# EAGLE design rev10 (EAGLE 7.5.0)
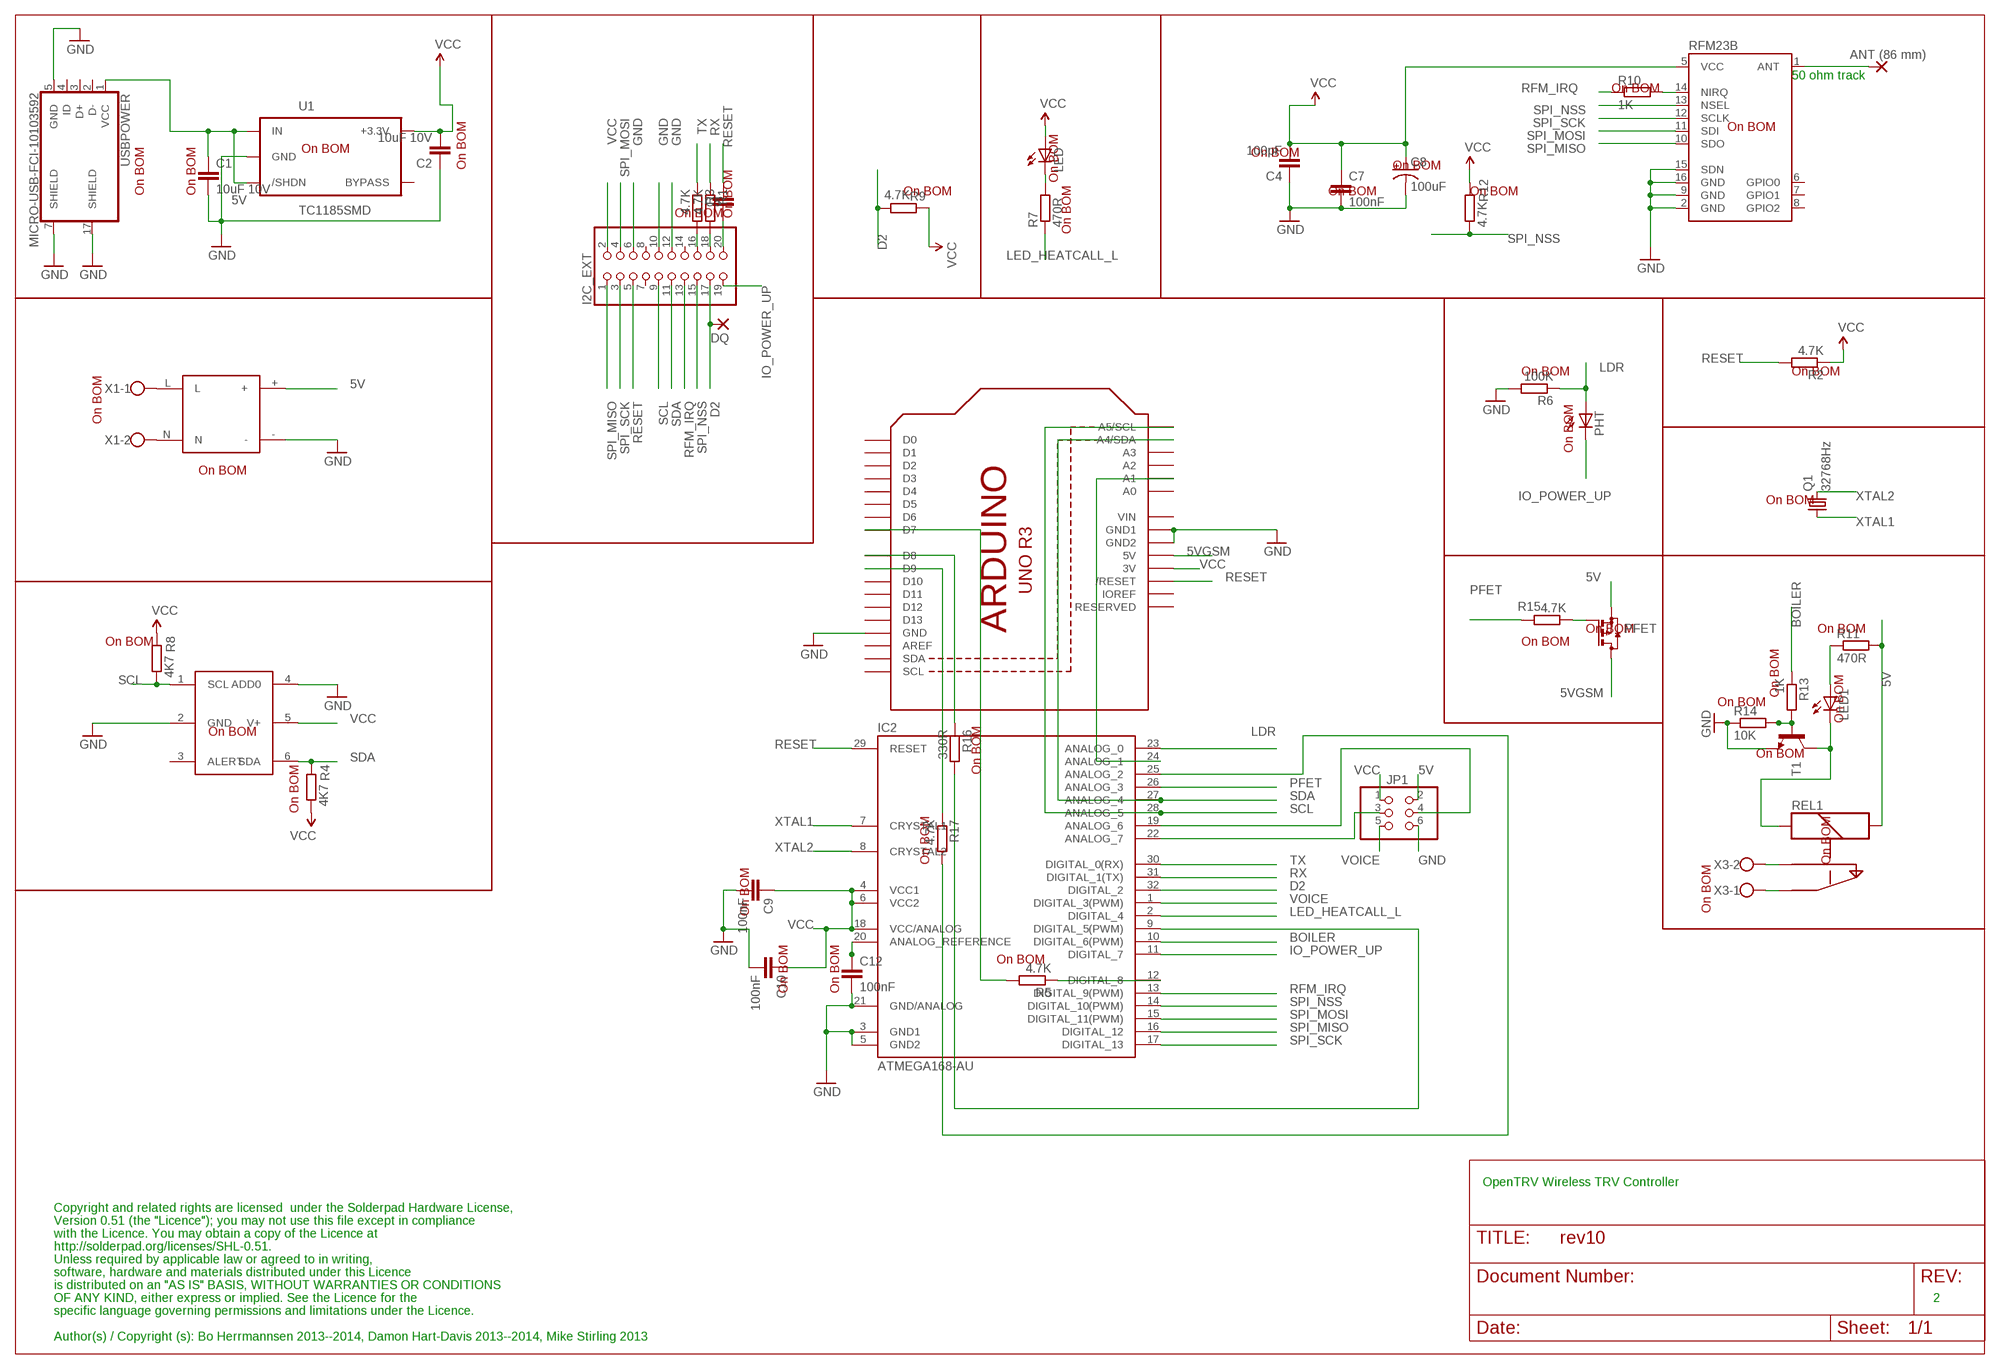
[diagram p0: schematic, sheet 1]

## Parts
ANT1  ANT (86 mm)  2,15/1,0  [2,15/1,0]
C1  10uF 10V  C-EUC0603  [C0603]
C2  10uF 10V  C-EUC0603  [C0603]
C4  100pF  C-EUC0603  [C0603]
C5  100nF  C-EUC0603  [C0603]
C7  100nF  C-EUC0603  [C0603]
C8  100uF  CAP_POL1206  [EIA3216]
C9  100nF  C-EUC0603  [C0603]
C10  100nF  C-EUC0603  [C0603]
C12  100nF  C-EUC0603  [C0603]
DQ  2,15/1,0  [2,15/1,0]
I2C_EXT  PINHD-2X10  [2X10]
IC2  ATMEGA168-AU  [TQFP32-08]
JP1  PINHD-2X3  [2X03]
LED  LEDCHIP-LED0603  [CHIP-LED0603]
LED1  LEDCHIP-LED0603  [CHIP-LED0603]
PFET  BSS84  [SOT23]
PHT  BPX65  [BPX65]
PSU  VTX-214-010-205  [VTX-214-010-205]
Q1  32768Hz  MC-306  [MC-306]
R1  4.7K  R-EU_R0603  [R0603]
R2  4.7K  R-EU_R0603  [R0603]
R3  4.7K  R-EU_R0603  [R0603]
R4  4K7  R-EU_R0603  [R0603]
R5  4.7K  R-EU_R0603  [R0603]
R6  100K  R-EU_R0603  [R0603]
R7  470R  R-EU_R0603  [R0603]
R8  4K7  R-EU_R0603  [R0603]
R9  4.7K  R-EU_R0603  [R0603]
R10  1K  R-EU_R0603  [R0603]
R11  470R  R-EU_R0603  [R0603]
R12  4.7K  R-EU_R0603  [R0603]
R13  1K  R-EU_R0603  [R0603]
R14  10K  R-EU_R0603  [R0603]
R15  4.7K  R-EU_R0603  [R0603]
R16  330R  R-EU_R0603  [R0603]
R17  4.7K  R-EU_R0603  [R0603]
REL1  OJE-SS-103HM  [OJE-SS-103HM]
RFM23B  RFM23B  [RFM23-XXX-S1]
T1  MMBTH24LT1-NPN-SOT23-BEC  [SOT23-BEC]
TMP112  TMP1  TMP112  [TMP112]
U1  TC1185SMD  [TC1185]
U$3  ARDUINO  [ARDUINO]
USBPOWER  MICRO-USB-FCI-10103592  [MICRO-USB-FCI-10103592]
X1  W237-102  [W237-102]
X3  W237-102  [W237-102]

## Nets
5V [supply]: C1.1 JP1.2 PFET.2(S) PSU.+ R11.2 REL1.S2 U1.1(IN) U1.3(/SHDN) USBPOWER.1(VCC)
5VGSM: PFET.3(D) U$3.5V
BOILER: IC2.10(DIGITAL_6(PWM)) R13.1
D2: DQ.1(P) I2C_EXT.17 IC2.32(DIGITAL_2) R9.1
GND [supply]: C1.2 C2.1 C4.1 C7.2 C8.C(-) C9.2 C10.2 C12.2 I2C_EXT.6 I2C_EXT.10 I2C_EXT.12 IC2.3(GND1) IC2.5(GND2) IC2.21(GND/ANALOG) JP1.6 PSU.- R6.2 R14.1 RFM23B.2(GND) RFM23B.9(GND) RFM23B.15(SDN) RFM23B.16(GND) T1.E TMP112.2(GND) TMP112.4(ADD0) U1.2(GND) U$3.GND U$3.GND1 U$3.GND2 USBPOWER.5(GND) USBPOWER.7(SHIELD) USBPOWER.17(SHIELD)
IO_POWER_UP [supply]: I2C_EXT.19 IC2.11(DIGITAL_7) PHT.K(C)
LDR: IC2.23(ANALOG_0) PHT.A R6.1
LED_HEATCALL_L: IC2.2(DIGITAL_4) R7.1
N$1: IC2.19(ANALOG_6) JP1.4
N$3: IC2.12(DIGITAL_8) R5.1
N$4: PSU.N X1.2
N$5: IC2.22(ANALOG_7) JP1.3
N$6 [supply]: C12.1 IC2.20(ANALOG_REFERENCE)
N$7: R10.2 RFM23B.14(NIRQ)
N$8: PSU.L X1.1
N$11: IC2.25(ANALOG_2) R17.2
N$12: R13.2 R14.2 T1.B
N$13: LED.C R7.2
N$14: LED1.C REL1.S1 T1.C
N$15: IC2.24(ANALOG_1) U$3.A1
N$16: LED1.A R11.1
N$17: PFET.1(G) R15.1
N$19: R5.2 U$3.D7
N$20: IC2.9(DIGITAL_5(PWM)) R16.2
N$21: REL1.C X3.1
N$22: REL1.S X3.2
N$24: I2C_EXT.18 R1.2
N$25: I2C_EXT.16 R3.2
N$26: C5.2 I2C_EXT.20
N$30: R17.1 U$3.D9
N$31 [ant]: ANT1.1(P) RFM23B.1(ANT)
N$32: R16.1 U$3.D8
PFET: IC2.26(ANALOG_3) R15.2
RESET: C5.1 I2C_EXT.5 IC2.29(RESET) R2.2 U$3.RESET(/RESET)
RFM_IRQ: I2C_EXT.13 IC2.13(DIGITAL_9(PWM)) R10.1
RX: IC2.31(DIGITAL_1(TX)) R1.1
SCL: I2C_EXT.9 IC2.28(ANALOG_5) R8.1 TMP112.1(SCL) U$3.A5(A5/SCL)
SDA: I2C_EXT.11 IC2.27(ANALOG_4) R4.2 TMP112.6(SDA) U$3.A4(A4/SDA)
SPI_MISO: I2C_EXT.1 IC2.16(DIGITAL_12) RFM23B.10(SDO)
SPI_MOSI: I2C_EXT.4 IC2.15(DIGITAL_11(PWM)) RFM23B.11(SDI)
SPI_NSS: I2C_EXT.15 IC2.14(DIGITAL_10(PWM)) R12.1 RFM23B.13(NSEL)
SPI_SCK: I2C_EXT.3 IC2.17(DIGITAL_13) RFM23B.12(SCLK)
TX: IC2.30(DIGITAL_0(RX)) R3.1
VCC [supply]: C2.2 C4.2 C7.1 C8.A(+) C9.1 C10.1 I2C_EXT.2 IC2.4(VCC1) IC2.6(VCC2) IC2.18(VCC/ANALOG) JP1.1 LED.A R2.1 R4.1 R8.2 R9.2 R12.2 RFM23B.5(VCC) TMP112.5(V+) U1.5(+3.3V) U$3.3V
VOICE: IC2.1(DIGITAL_3(PWM)) JP1.5
XTAL1: IC2.7(CRYSTAL1) Q1.1
XTAL2: IC2.8(CRYSTAL2) Q1.4
Unconnected: I2C_EXT.7 I2C_EXT.8 I2C_EXT.14 RFM23B.6(GPIO0) RFM23B.7(GPIO1) RFM23B.8(GPIO2) TMP112.3(ALERT) U1.4(BYPASS) U$3.A0 U$3.A2 U$3.A3 U$3.AREF U$3.D0 U$3.D1 U$3.D2 U$3.D3 U$3.D4 U$3.D5 U$3.D6 U$3.D10 U$3.D11 U$3.D12 U$3.D13 U$3.IOREF U$3.RESERVED U$3.SCL U$3.SDA USBPOWER.2(D-) USBPOWER.3(D+) USBPOWER.4(ID)

## Notes on the sheet
- 50 ohm track
- On BOM
- On BOM
- On BOM
- On BOM
- On BOM | On BOM | On BOM
- On BOM
- On BOM | On BOM | On BOM | On BOM | On BOM
- On BOM
- On BOM
- On BOM | On BOM | On BOM
- On BOM
- On BOM
- On BOM
- On BOM | On BOM
- On BOM | On BOM
- On BOM | On BOM
- On BOM
- On BOM
- On BOM
- On BOM
- On BOM
- On BOM | On BOM | On BOM
- On BOM
- On BOM
- On BOM | On BOM
- OpenTRV Wireless TRV Controller
- Copyright and related rights are licensed  under the Solderpad Hardware License,
- Version 0.51 (the "Licence"); you may not use this file except in compliance
- with the Licence. You may obtain a copy of the Licence at
- http://solderpad.org/licenses/SHL-0.51.
- Unless required by applicable law or agreed to in writing,
- software, hardware and materials distributed under this Licence
- is distributed on an "AS IS" BASIS, WITHOUT WARRANTIES OR CONDITIONS
- OF ANY KIND, either express or implied. See the Licence for the | 2
- specific language governing permissions and limitations under the Licence.
- Author(s) / Copyright (s): Bo Herrmannsen 2013--2014, Damon Hart-Davis 2013--2014, Mike Stirling 2013

## Power pins joined to a net without a drawn wire
VIN: U$3.VIN

## Library data of the parts
ANT1 DQ = wirepad:2,15/1,0: THROUGH-HOLE PAD
C1 C2 C4 C5 C7 C9 C10 C12 = resistor:C-EU: CAPACITOR, European symbol
C8 = SparkFun-Passives:CAP_POL: Capacitor Polarized These are standard SMD and PTH capacitors. Normally 10uF, 47uF, and 100uF in electrolytic and tantalum varieties. Always verify the external diameter of the through hole cap, it varies with capacity, voltage, and manufacturer. The EIA devices should be standard.
I2C_EXT = pinhead:PINHD-2X10: PIN HEADER
IC2 = Arduino-AVR:ATMEGA168
JP1 = pinhead:PINHD-2X3: PIN HEADER
LED LED1 = led:LED: LED OSRAM: - CHIPLED LG R971, LG N971, LY N971, LG Q971, LY Q971, LO R971, LY R971 LH N974, LH R974 LS Q976, LO Q976, LY Q976 LO Q996 - Hyper CHIPLED LW Q18S LB Q993, LB Q99A, LB R99A - SideLED LS A670, LO A670, LY A670, LG A670, LP A670 LB A673, LV A673, LT A673, LW A673 LH A674 LY A675 LS A676, LA A676, LO A676, LY A676, LW A676 LS A679, LY A679, LG A679 - Hyper Micro SIDELED® LS Y876, LA Y876, LO Y876, LY Y876 LT Y87S - SmartLED LW L88C, LW L88S LB L89C, LB L89S, LG L890 LS L89K, LO L89K, LY L89K LS L896, LA L896, LO L896, LY L896 - TOPLED LS T670, LO T670, LY T670, LG T670, LP T670 LSG T670, LSP T670, LSY T670, LOP T670, LYG T670 LG T671, LOG T671, LSG T671 LB T673, LV T673, LT T673, LW T673 LH T674 LS T676, LA T676, LO T676, LY T676, LB T676, LH T676, LSB T676, LW T676 LB T67C, LV T67C, LT T67C, LS T67K, LO T67K, LY T67K, LW E67C LS E67B, LA E67B, LO E67B, LY E67B, LB E67C, LV E67C, LT E67C LW T67C LS T679, LY T679, LG T679 LS T770, LO T770, LY T770, LG T770, LP T770 LB T773, LV T773, LT T773, LW T773 LH T774 LS E675, LA E675, LY E675, LS T675 LS T776, LA T776, LO T776, LY T776, LB T776 LHGB T686 LT T68C, LB T68C - Hyper Mini TOPLED® LB M676 - Mini TOPLED Santana® LG M470 LS M47K, LO M47K, LY M47K Source: http://www.osram.convergy.de LUXEON: - LUMILED® LXK2-PW12-R00, LXK2-PW12-S00, LXK2-PW14-U00, LXK2-PW14-V00 LXK2-PM12-R00, LXK2-PM12-S00, LXK2-PM14-U00 LXK2-PE12-Q00, LXK2-PE12-R00, LXK2-PE12-S00, LXK2-PE14-T00, LXK2-PE14-U00 LXK2-PB12-K00, LXK2-PB12-L00, LXK2-PB12-M00, LXK2-PB14-N00, LXK2-PB14-P00, LXK2-PB14-Q00 LXK2-PR12-L00, LXK2-PR12-M00, LXK2-PR14-Q00, LXK2-PR14-R00 LXK2-PD12-Q00, LXK2-PD12-R00, LXK2-PD12-S00 LXK2-PH12-R00, LXK2-PH12-S00 LXK2-PL12-P00, LXK2-PL12-Q00, LXK2-PL12-R00 Source: www.luxeon.com KINGBRIGHT: KA-3528ASYC Source: www.kingbright.com
PFET = transistor-small-signal:BSS84: P-CHANNEL MOS FET
PHT = opto-trans-siemens:BPX65: PHOTO DIODE; MPN: BPX65.; OC_FARNELL: 327451; OC_NEWARK: 06WX2764
PSU = VTX-214-010-205:VTX-214-010-205
Q1 = crystal:MC-306: kHz RANGE CRYSTAL UNIT SMD Source: MC-306_405_406_E07X.PDF Homepage <http://www.epsontoyocom.co.jp>; MPN: MC-306 60.0KHZ 100PPM ,12.5PF; OC_FARNELL: 1278040; OC_NEWARK: 31M5576
R1-R17 = resistor:R-EU_: RESISTOR, European symbol
REL1 = OJE-SS-103HM:OJE-SS-103HM: RELAY
RFM23B = SparkFun-RF:RFM23B
T1 = transistor:*-NPN-: NPN Transistror BF959 corrected 2008.03.06
TMP112 = TMP112_2:TMP112
U1 = 3.3VREG:TC1185
U$3 = arduino:ARDUINO
USBPOWER = micro-usb-fci-10103592:MICRO-USB-FCI-10103592: Micro USB B Connector RS No: 714-2334 MRF No: 10103592-0001LF
X1 X3 = con-wago-500:W237-102: WAGO SCREW CLAMP; MPN: 237-102; OC_FARNELL: unknown; OC_NEWARK: 70K9898

## Net classes
0 default: width 0.203 mm
1 supply: width 0.406 mm, clearance 0.203 mm
2 ant: width 2.184 mm

## Board
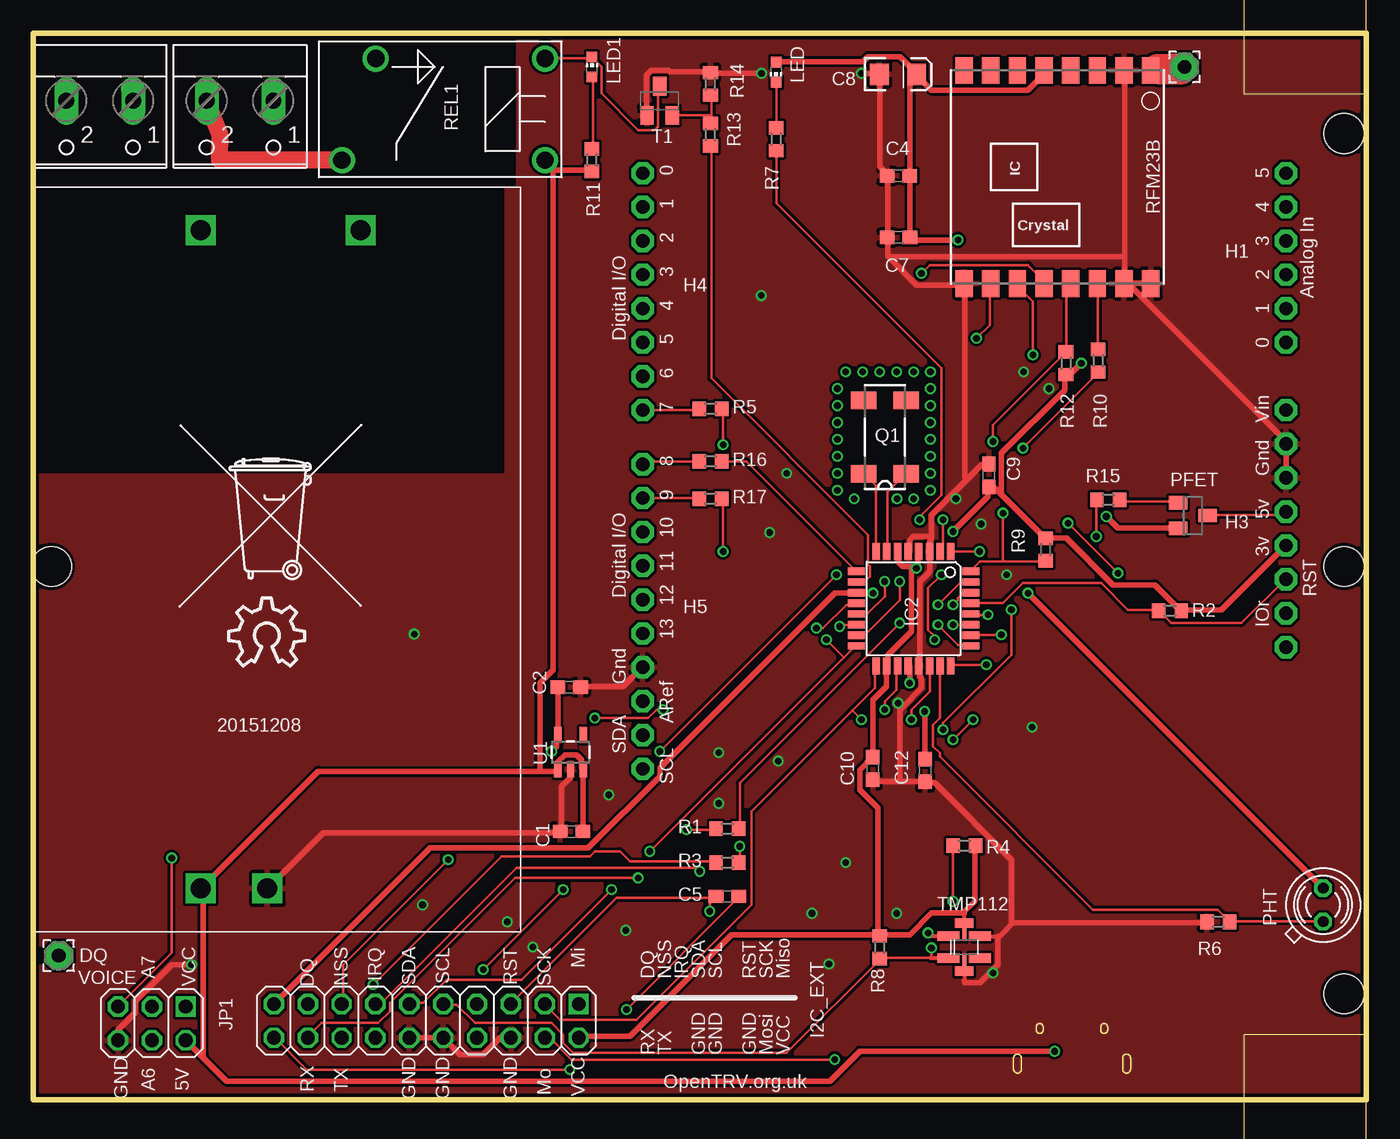
[diagram p1: board, top side]
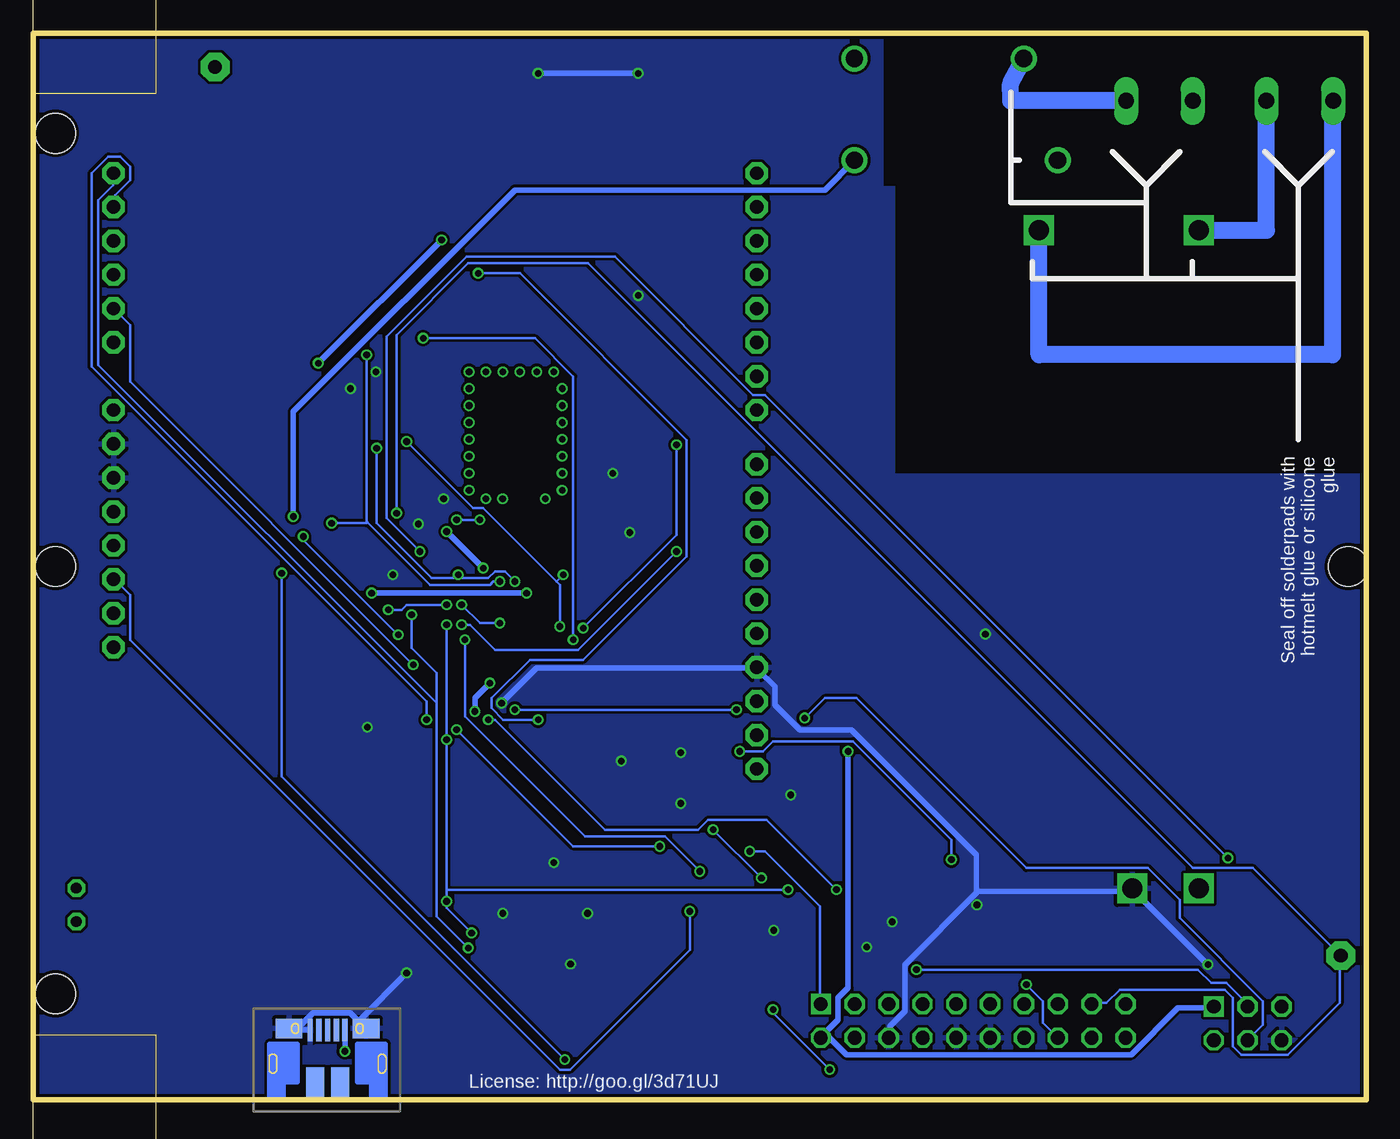
[diagram p2: board, bottom side, seen from below]

Size 100 x 80 mm. Coordinates in mm from the lower left corner, seen from the top.
Outline: 0,0 0,80 100,80 100,0 0,0
Copper layers (1*16): Top 0.035mm / dielectric 1.5mm / Bottom 0.035mm
Design rules "PMServicesStd *": minimum track width 8mil, minimum drill 0.5mm, track to track 8mil, track to pad 8mil, pad to pad 8mil, via to via 8mil, smd to smd 0mil, copper to edge 10mil, drill to drill 10mil, minimum pad ring 10mil, minimum via ring 6mil, stop-mask expansion 2mil, vias tented up to drill 100mil, thermal gap 10mil
Holes 3 mm at 98.33,7.93 98.33,72.5 1.35,40 98.33,40
tRestrict: area 0,52.1 to 30.2,76.8; area 0,47 to 30.2,71.8; area 29.8,68.6 to 36.2,80; area 5.1,47 to 35.3,71.8
bRestrict: area 0,52.1 to 30.2,76.8; area 0,47 to 30.2,71.8; area 29.8,68.6 to 36.2,80; area 5.1,47 to 35.3,71.8
Milling: area 90.8,-4.3 to 100,4.8; area 90.8,75.5 to 100,84.7

### Footprints (pad centres in the part's own frame; a part is rotated, then mirrored left to right if it is on the bottom)
2,15/1,0 = drill 1.016 pad 2.159 octagon: 1 0,0
C0603 = smd 1.1 x 1: 1 -0.85,0; 2 0.85,0
EIA3216 = smd 1.4 x 1.6: A 1.4,0; C -1.4,0
2X10 = drill 1.016 square: 1 -11.43,-1.27 | drill 1.016 octagon: 2 -11.43,1.27; 3 -8.89,-1.27; 4 -8.89,1.27; 5 -6.35,-1.27; 6 -6.35,1.27; 7 -3.81,-1.27; 8 -3.81,1.27; 9 -1.27,-1.27; 10 -1.27,1.27; 11 1.27,-1.27; 12 1.27,1.27; 13 3.81,-1.27; 14 3.81,1.27; 15 6.35,-1.27; 16 6.35,1.27; 17 8.89,-1.27; 18 8.89,1.27; 19 11.43,-1.27; 20 11.43,1.27
TQFP32-08 = smd 1.27 x 0.559: 1 -4.293,2.8; 2 -4.293,2; 3 -4.293,1.2; 4 -4.293,0.4; 5 -4.293,-0.4; 6 -4.293,-1.2; 7 -4.293,-2; 8 -4.293,-2.8; 17 4.293,-2.8; 18 4.293,-2; 19 4.293,-1.2; 20 4.293,-0.4; 21 4.293,0.4; 22 4.293,1.2; 23 4.293,2; 24 4.293,2.8 | smd 0.559 x 1.27: 9 -2.8,-4.293; 10 -2,-4.293; 11 -1.2,-4.293; 12 -0.4,-4.293; 13 0.4,-4.293; 14 1.2,-4.293; 15 2,-4.293; 16 2.8,-4.293; 25 2.8,4.293; 26 2,4.293; 27 1.2,4.293; 28 0.4,4.293; 29 -0.4,4.293; 30 -1.2,4.293; 31 -2,4.293; 32 -2.8,4.293
2X03 = drill 1.016 square: 1 -2.54,-1.27 | drill 1.016 octagon: 2 -2.54,1.27; 3 0,-1.27; 4 0,1.27; 5 2.54,-1.27; 6 2.54,1.27
CHIP-LED0603 = smd 0.8 x 0.8: A 0,-0.75; C 0,0.75
SOT23 = smd 1 x 1.4: 1 -0.95,-1.1; 2 0.95,-1.1; 3 0,1.1
BPX65 = drill 0.813 octagon: A -0.889,-0.889; K 0.889,0.889
VTX-214-010-205 = drill 1.5 square: + 52.75,9.24; - 52.75,14.24; L 3.36,9.24; N 3.36,21.24
MC-306 = smd 1.3 x 1.9: 1 -2.75,-1.6; 2 2.75,-1.6; 3 2.75,1.6; 4 -2.75,1.6
R0603 = smd 1 x 1.1: 1 -0.85,0; 2 0.85,0
OJE-SS-103HM = drill 1.3: C 13.95,1.29; S 16.49,8.91; S1 1.25,1.29; S2 1.25,8.91
RFM23-XXX-S1 = smd 2 x 1.3: 1 -8,7; 2 -8,5; 3 -8,3; 4 -8,1; 5 -8,-1; 6 -8,-3; 7 -8,-5; 8 -8,-7; 9 8,-7; 10 8,-5; 11 8,-3; 12 8,-1; 13 8,1; 14 8,3; 15 8,5; 16 8,7
SOT23-EBC = smd 1 x 1.4: B 0.95,-1.1; C 0,1.1; E -0.95,-1.1
TMP112 = smd 0.285 x 0.7: 1 -0.5,-0.825; 2 0,-0.825; 3 0.5,-0.825; 4 0.5,0.825; 5 0,0.825; 6 -0.5,0.825; 7 0.777,-0.825; 8 1.325,-0.825; 9 1.05,-0.825; 10 1.868,-0.826; 11 1.595,-0.826; 12 -1.863,-0.825; 13 -1.314,-0.825; 14 -1.59,-0.825; 15 -0.772,-0.825; 16 -1.044,-0.825; 17 -1.86,0.822; 18 -1.312,0.822; 19 -1.587,0.822; 20 -0.769,0.821; 21 -1.041,0.821; 22 0.766,0.824; 23 1.315,0.824; 24 1.039,0.824; 25 1.857,0.823; 26 1.585,0.823; 27 -0.548,1.797; 28 0,1.797; 29 -0.275,1.797; 30 0.543,1.797; 31 0.271,1.797; 32 0.001,1.383; 33 -0.548,-1.798; 34 0,-1.798; 35 -0.275,-1.798; 36 0.543,-1.799; 37 0.271,-1.799; 38 0,-1.322
TC1185 = smd 0.55 x 1.2: 1 -0.95,-1.3; 2 0,-1.3; 3 0.95,-1.3; 4 0.95,1.3; 5 -0.95,1.3
ARDUINO = drill 1 pad 1.676 octagon: 3V 26.67,5.08; 5V 29.21,5.08; A0 41.91,5.08; A1 44.45,5.08; A2 46.99,5.08; A3 49.53,5.08; A4 52.07,5.08; A5 54.61,5.08; AREF 14.986,53.34; D0 54.61,53.34; D1 52.07,53.34; D2 49.53,53.34; D3 46.99,53.34; D4 44.45,53.34; D5 41.91,53.34; D6 39.37,53.34; D7 36.83,53.34; D8 32.766,53.34; D9 30.226,53.34; D10 27.686,53.34; D11 25.146,53.34; D12 22.606,53.34; D13 20.066,53.34; GND 17.526,53.34; GND1 34.29,5.08; GND2 31.75,5.08; IOREF 21.59,5.08; RESERVED 19.05,5.08; RESET 24.13,5.08; SCL 9.906,53.34; SDA 12.446,53.34; VIN 36.83,5.08
MICRO-USB-FCI-10103592 = smd 0.4 x 1.71: 1 3.84,2.51; 2 3.19,2.51; 3 2.54,2.51; 4 1.89,2.51; 5 1.24,2.51 | smd 2 x 1.46: 7 -0.36,2.64; 17 5.44,2.64 | smd 1.375 x 2.5: 11 1.603,-1.52; 12 3.478,-1.52
W237-102 = drill 1.194 long: 1 -2.5,-1.27; 2 2.5,-1.27

### Placement (x,y rotation side)
ANT1  86.36,77.47 0 top
C1  40.38,20.12 180 top
C2  40.2,30.94 180 top
C4  64.91,69.3 0 top
C5  52.07,15.24 0 top
C7  64.92,64.68 180 top
C8  64.89,76.92 0 top
C9  71.69,46.83 90 top
C10  62.98,24.84 270 top
C12  66.91,24.69 270 top
DQ  1.91,10.79 0 top
I2C_EXT  29.48,5.9 180 top
IC2  66.04,36.83 270 top
JP1  8.89,5.71 180 top
LED  55.73,77.08 180 top
LED1  41.91,77.47 0 top
PFET  87,43.81 270 top
PHT  96.77,14.61 45 top
PSU  3.31,68.58 270 top
Q1  63.89,49.71 90 top
R1  52.07,20.32 180 top
R2  85.28,36.67 180 top
R3  52.07,17.78 180 top
R4  69.85,19.05 180 top
R5  50.8,51.84 180 top
R6  88.9,13.34 180 top
R7  55.73,72.05 90 top
R8  63.5,11.43 90 top
R9  75.94,41.27 90 top
R10  79.9,55.43 90 top
R11  41.91,70.48 270 top
R12  77.47,55.24 270 top
R13  50.8,72.39 90 top
R14  50.8,76.2 270 top
R15  80.64,44.99 180 top
R16  50.8,47.88 0 top
R17  50.8,45.09 0 top
REL1  39.64,79.39 180 top
RFM23B  76.83,69.22 270 top
T1  [SOT23-EBC]  46.99,74.93 0 top
TMP112  69.85,11.43 0 top
U1  40.31,26.05 0 top
U$1  [OSHW_10X200_NOTEXT]  14.67,32.54 0 top
U$2  [TONNE]  17.64,41.06 0 top
U$3  99.06,14.9 90 top
USBPOWER  80.47,2.7 0 bottom
X1  4.98,73.66 180 top
X3  15.51,73.66 180 top

### Tracks (layer width: path | path; a pad name or v marks a point on that pad's centre or on a via)
5V  (via drill 0.5)
  Top 0.406: 39.12,69.75 41.88,69.75 R11.2 | REL1.S2 39.12,69.75 | v80.5,43.75 81.38,42.88 85.88,42.88 PFET.2 | C1.1 41.25,20.12 U1.3 41.12,24.88 41.12,25.5 40.75,25.88 39.88,25.88 39.38,25.38 39.38,24.88 U1.1 39.25,24.62 38,24.62 | 38,24.62 21.38,24.62 12.62,15.88 PSU.+ 12.75,15.75 12.75,3.38 12.62,3.25 | v76.62,3.62 62,3.62 59.75,1.38 14.5,1.38 12.62,3.25 | JP1.2 12.62,3.25 | 38,24.62 38,31.25 39,32.25 39,69.62 39.12,69.75
  Bottom 0.406: v80.5,43.75 80.5,51.62 63.88,68.25 40.62,68.25 REL1.S2 | v76.62,3.62 USBPOWER.1
5VGSM
  Top 0.203: PFET.3 88.12,43.88 93.75,43.88 93.88,44 U$3.5V
BOILER
  Top 0.203: R13.1 50.88,71.5 50.88,54.12 62.62,42.38 62.62,40.12 62.75,40 62.75,39.25 62.38,38.88 61.75,38.88 IC2.10
D2  (via drill 0.5)
  Top 0.203: 72.75,40.38 71,40.38 70.38,39.75 IC2.32 | 72.75,40.38 75.88,40.38 R9.1 | v72.75,44 72.75,40.38
  Bottom 0.203: I2C_EXT.17 20.5,7.25 19.5,7.25 18.5,8.25 10.62,8.25 10,7.62 10,4 9.38,3.38 5.88,3.38 2,7.25 2,10.75 DQ.1 2,10.88 8.5,17.38 13,17.38 58.38,62.75 67.38,62.75 72.75,57.38 v72.75,44
GND  (via drill 0.5)
  Top 0.305: TMP112.4 72.38,12.26 72.39,12.26 | TMP112.2 69.85,8.89
  Top 0.406: I2C_EXT.12 28.25,4.62 I2C_EXT.10 30.88,4.5 32,3.38 33.75,3.38 35,4.62 35.75,4.62 I2C_EXT.6 | U1.2 40.25,24.75 40.25,24.12 39.62,23.5 39.62,20.12 C1.2 39.38,20 21.75,20 17.62,15.88 PSU.- | v11.88,10.12 10.38,10.12 7.62,7.38 7.62,6.5 6.38,5.25 6.38,4.5 JP1.6 | U$3.GND2 94,46.75 94,49.12 U$3.GND1 94,49.38 82.25,61.12 RFM23B.15 | 81.88,77.25 RFM23B.2 81.88,77.12 81.88,63.25 | RFM23B.15 81.88,61.25 83.75,61.25 RFM23B.16 83.88,61.25 | 81.88,63.25 81.88,61.38 RFM23B.15 | T1.E 46,73.88 46,76.88 46.38,77.25 47.62,77.25 47.75,77.12 50.75,77.12 R14.1 50.88,77 v54.62,77 | 69.88,61.25 RFM23B.9 | 64.25,63.12 64.12,63.25 64.12,64.5 C7.2 64.12,64.75 64.12,69.25 C4.1 64,69.5 63.5,70 63.5,76.88 C8.C 63.38,77 v62.12,77 | 64.25,63.12 66.25,61.12 69.75,61.12 RFM23B.9 | 73.5,13.25 88,13.25 R6.2 | 73.5,13.25 72.5,12.25 72.39,12.26 | 71.88,9.62 72.38,10.12 72.38,12.26 | 71.88,9.62 71,8.75 69.88,8.75 69.85,8.89 | v72,9.5 71.88,9.62 | C2.1 41.12,31 44.25,31 45.62,32.38 U$3.GND | 65,23.88 63,23.88 C10.2 | 65,23.88 66.88,23.88 C12.2 67,23.75 67.62,23.75 73.38,18 73.38,13.38 73.5,13.25 | 70,46.5 67.38,43.88 67.38,42.25 | 70,46.5 71.12,47.62 71.62,47.62 C9.2 | 67.38,42.25 67.38,42 67.25,41.88 IC2.3 67.25,41 67.25,39.62 66.5,38.88 66.5,32.62 IC2.21 66.5,32.38 66.5,31.75 66.62,31.62 66.62,30.88 65.19,29.44 | 67.38,42.25 66,42.25 65.75,42 65.75,41.12 IC2.5 | 65,23.88 65,29.25 65.19,29.44 | 65.19,29.44 v64.88,29.75 | RFM23B.9 69.88,61 69.88,46.62 70,46.5 | 81.88,63.25 64.38,63.25 64.25,63.12
  Bottom 0.406: v11.88,10.12 17.5,15.75 PSU.- 17.62,15.62 29.12,15.62 | 29.12,15.62 34.62,10.12 34.62,6.62 35.75,5.5 35.75,4.75 I2C_EXT.6 | v62.12,77 v54.62,77 | USBPOWER.5 79.25,5.25 80.75,5.25 USBPOWER.7 80.12,5.38 79,6.5 76.25,6.5 75.12,5.38 USBPOWER.17 75.5,6 v72,9.5 | v64.88,29.75 62.25,32.38 45.75,32.38 U$3.GND 45.62,32.25 44.38,31 44.38,29.62 42.5,27.75 38.62,27.75 29.25,18.38 29.25,15.75 29.12,15.62
  other vias: 64.77,13.97 58.42,13.97 59.69,10.16 44.45,12.7 51.44,26.04 28.57,34.92 55.24,42.55 54.61,60.33 56.52,46.99 60.96,17.78 74.93,27.94 35.56,13.34 29.21,14.61 43.18,22.86 37.47,11.43 51.44,22.23 55.88,25.4 73.03,39.37 69.22,45.09 71.12,43.18 76.2,53.34 74.3,54.61
  pour Bottom: 0,80.01 0,0 100.33,0 100.33,80.01
  pour Top: 0,80.01 0,0 100.33,0 100.33,80.01
IO_POWER_UP  (via drill 0.5)
  Top 0.406: I2C_EXT.19 18.12,7.25 29.75,18.88 41.62,18.88 47,24.25 47,24.88 60.12,38 61.62,38 IC2.11 61.88,38 v63,38 | v74.62,38 96.75,15.88 PHT.K
  Bottom 0.406: v63,38 v74.62,38
LDR
  Top 0.203: 89.75,13.38 96.75,13.38 PHT.A | 89.75,13.38 88.88,14.25 79.5,14.25 68,25.75 68,26 67.5,26.5 67.5,28.12 68,28.62 68,32.5 IC2.23 | 89.75,13.38 R6.1
LED_HEATCALL_L  (via drill 0.5)
  Top 0.203: v66.5,43.5 66.5,43.75 68.12,45.38 68.12,54.88 55.75,67.25 55.75,71.12 R7.1 | v68.25,43.5 68.25,41.25 68.12,41.12 IC2.2
  Bottom 0.203: v68.25,43.5 v66.5,43.5
N$1  (via drill 0.5)
  Top 0.203: v63.88,29.25 63.88,29.88 64.75,30.75 64.75,32.5 IC2.19 | v47.25,29.25 46.75,29.25 46.12,28.62 v42.12,28.62
  Bottom 0.203: v47.25,29.25 v63.88,29.25 | v42.12,28.62 40.62,30.12 38.25,30.12 25.5,17.38 16.38,17.38 14,15 14,13.62 7.75,7.38 7.75,5.62 8.88,4.5 JP1.4
N$3  (via drill 0.5)
  Top 0.203: v51.75,49.12 51.75,51.75 R5.1 | v58.75,35.38 59.25,35.38 61,37.12 61.62,37.12 IC2.12
  Bottom 0.203: v51.75,49.12 51.75,42.38 v58.75,35.38
N$4
  Bottom 0.406: X1.2 2.54,74.93
  Bottom 1.27: 2.54,74.93 2.54,55.88 24.55,55.88 PSU.N
N$5  (via drill 0.5)
  Top 0.203: v65.88,28.5 65.88,29.25 67.25,30.62 67.25,32.5 IC2.22 | v33.75,9.75 v39.75,15.75
  Bottom 0.203: v65.88,28.5 65.38,28.5 57.12,20.25 50.12,20.25 49.38,21 45,21 v39.75,15.75 | v33.75,9.75 12.62,9.75 11.62,8.75 10.5,8.75 9,7.25 9,7 JP1.3
N$6  (via drill 0.5)
  Top 0.406: v66.88,29.12 66.88,25.62 C12.1 | v65.75,31.25 65.75,32.5 IC2.20
  Bottom 0.406: v66.88,29.12 66.88,30.12 v65.75,31.25
N$7
  Top 0.203: R10.2 79.88,56.38 79.88,61.12 RFM23B.14
N$8
  Bottom 1.27: PSU.L 7.48,65.22 X1.1
N$11  (via drill 0.5)
  Top 0.203: v51.75,41.12 51.75,45 R17.2 | v67.88,35.62 69.38,34.12 70.25,34.12 IC2.25
  Bottom 0.203: v51.75,41.12 59.12,33.75 65.38,33.75 67.25,35.62 v67.88,35.62
N$12
  Top 0.203: 50.88,73.88 50.88,75.25 R14.2 50.88,75.38 | 50.88,73.88 50.88,73.25 R13.2 | 50.88,73.88 48,73.88 T1.B
N$13
  Top 0.203: LED.C 55.75,76.25 55.75,73 R7.2
N$14
  Top 0.203: 38.41,78.03 REL1.S1 38.5,78.12 41.88,78.12 LED1.C 42,78.12 42.62,77.5 42.62,75.5 45.38,72.75 46.62,72.75 46.88,73 46.88,76 T1.C
N$15  (via drill 0.5)
  Top 0.203: v71.5,32.62 68.88,32.62 IC2.24
  Bottom 0.203: v71.5,32.62 92.75,53.88 92.75,58.12 93.88,59.25 U$3.A1
N$16
  Top 0.203: LED1.A 42,76.62 42,71.38 R11.1
N$17
  Top 0.203: R15.1 81.5,44.88 85.88,44.88 PFET.1
N$19
  Top 0.203: R5.2 49.88,51.75 45.75,51.75 U$3.D7
N$20
  Top 0.203: R16.2 51.75,47.88 53.5,47.88 61.62,39.75 IC2.9
N$21
  Bottom 1.27: X3.1 26.67,74.93 26.69,76.2 REL1.C
N$22
  Top 1.27: REL1.S 13.97,70.48 14.01,72.39 X3.2
N$24  (via drill 0.5)
  Top 0.203: v49,20.25 51.12,20.25 R1.2 | v45.38,16.62 36.12,16.62 26.75,7.25 26.75,6.62 25.88,5.75 21.62,5.75 20.62,4.75 I2C_EXT.18
  Bottom 0.203: v45.38,16.62 v49,20.25
N$25  (via drill 0.5)
  Top 0.203: v25.5,8.62 35.12,18.25 41.75,18.25 42.12,18.62 44,18.62 44.75,17.88 51.12,17.88 R3.2
  Bottom 0.203: v25.5,8.62 24.25,7.38 24.25,5.75 I2C_EXT.16
N$26  (via drill 0.5)
  Top 0.203: v44.5,6.75 52.88,15.12 C5.2 | v40.25,2.25 20.5,2.25 18.12,4.62 I2C_EXT.20
  Bottom 0.203: v44.5,6.75 44.5,6.5 v40.25,2.25
N$28  (via drill 0.5)
  other vias: 61.59,45.09
N$30
  Top 0.203: R17.1 49.88,45.12 45.75,45.12 U$3.D9
N$31
  Top 1.27: 84.51,77.25 RFM23B.1
  Top 2.184: 84.51,77.25 86.12,77.25 84.34,77.38 ANT1.1
N$32
  Top 0.203: R16.1 49.88,47.88 45.88,47.88 45.75,47.75 U$3.D8
N$33  (via drill 0.5)
  other vias: 60.33,46.99
N$34  (via drill 0.5)
  other vias: 67.31,45.72
N$35  (via drill 0.5)
  other vias: 62.23,54.61
N$36  (via drill 0.5)
  other vias: 60.96,54.61
N$37  (via drill 0.5)
  other vias: 60.33,53.34
N$38  (via drill 0.5)
  other vias: 60.33,52.07
N$39  (via drill 0.5)
  other vias: 60.33,50.8
N$40  (via drill 0.5)
  other vias: 60.33,49.53
N$41  (via drill 0.5)
  other vias: 60.33,48.26
N$42  (via drill 0.5)
  other vias: 63.5,54.61
N$43  (via drill 0.5)
  other vias: 64.77,54.61
N$44  (via drill 0.5)
  other vias: 66.04,54.61
N$45  (via drill 0.5)
  other vias: 67.31,54.61
N$46  (via drill 0.5)
  other vias: 67.31,53.34
N$47  (via drill 0.5)
  other vias: 67.31,52.07
N$48  (via drill 0.5)
  other vias: 67.31,50.8
N$49  (via drill 0.5)
  other vias: 67.31,49.53
N$50  (via drill 0.5)
  other vias: 67.31,48.26
N$51  (via drill 0.5)
  other vias: 67.31,46.99
N$52  (via drill 0.5)
  other vias: 60.33,45.72
N$53  (via drill 0.5)
  other vias: 66.04,45.09
N$54  (via drill 0.5)
  other vias: 64.8,45.08
PFET  (via drill 0.5)
  Top 0.203: v79.75,42.25 79.75,44.88 R15.2 | v72.62,34.88 70.38,34.88 IC2.26
  Bottom 0.203: v79.75,42.25 79.75,42 v72.62,34.88
RESET  (via drill 0.5)
  Top 0.203: 50.75,15.12 43.75,15.12 35.88,7.25 I2C_EXT.5 | 50.75,15.12 51.12,15.12 C5.1 50.75,15.12 | U$3.RESET 93.88,39 90.62,35.75 85.38,35.75 84.5,36.62 R2.2 84.38,36.75 82.12,36.75 80.12,38.75 74.25,38.75 72.75,37.25 70.38,37.25 IC2.29 | v50.75,14.12 50.75,15.12
  Bottom 0.203: v50.75,14.12 50.75,11.25 59.75,2.25 60.5,2.25 92.75,34.5 92.75,37.88 93.88,39 U$3.RESET
RFM_IRQ  (via drill 0.5)
  Top 0.203: v74.25,48.88 79.88,54.5 R10.1 | v63.88,38.88 63.88,37.75 62.62,36.5 61.75,36.5 IC2.13 | v50,17.12 49.75,17.38 36.25,17.38 26.12,7.25 25.75,7.25 I2C_EXT.13 | v67.62,34.5 67.62,34.75 67.12,35.25 67.12,38.38 v68.12,39.38
  Bottom 0.203: v74.25,48.88 74.25,43.25 70.12,39.12 68.12,39.12 | 68.12,39.12 65.88,39.12 65.38,39.62 64.62,39.62 v63.88,38.88 | v50,17.12 52.62,19.75 58.62,19.75 67.62,28.75 v67.62,34.5 | 68.12,39.12 v68.12,39.38
RX  (via drill 0.5)
  Top 0.203: v65,35.75 53,23.75 53,20.38 R1.1 | v67.88,37.12 69.5,38.75 70.25,38.75 IC2.31
  Bottom 0.203: v65,35.75 66.5,35.75 v67.88,37.12
SCL  (via drill 0.5)
  Top 0.203: 67.31,10.61 67.25,10.62 63.5,10.62 R8.1 63.5,10.5 56.5,3.5 40.5,3.5 39.75,4.25 39.75,4.88 38.88,5.75 33.12,5.75 31.75,7.12 30.75,7.12 I2C_EXT.9 | v71.62,36.38 70.38,36.38 IC2.28 | 67.38,10.61 v67.38,11.38
  Top 0.305: TMP112.1 67.38,10.61 67.31,10.61
  Bottom 0.203: v71.62,36.38 71.62,33.88 69.75,32 69.75,29.75 | 69.75,29.75 69.75,13.75 v67.38,11.38 | 69.75,29.75 95.12,55.12 95.12,67.5 94,68.62 94,69.5 U$3.A5
SDA  (via drill 0.5)
  Top 0.203: v69,14.88 R4.2 | v67.12,12.5 67.25,12.38 67.31,12.26 | v69,35.62 70.25,35.62 IC2.27 | v43.38,15.75 36.62,9 31,9 29.25,7.25 28.25,7.25 I2C_EXT.11 | v69,27 v70.5,28.5
  Top 0.305: TMP112.6 67.31,12.26
  Bottom 0.203: v67.12,12.5 69,14.38 v69,14.88 69,15.75 | 69,15.75 v69,27 v69,35.62 | 69,15.75 v43.38,15.75 | v70.5,28.5 70.5,29.88 95.62,55 95.62,69.5 94.38,70.75 93.5,70.75 92.75,70 92.75,69 93.88,67.88 93.88,67 U$3.A4
SPI_MISO  (via drill 0.5)
  Top 0.203: v46.25,18.62 60.81,33.19 | 60.81,33.19 61.62,34 IC2.16 | v70.75,57.12 71.75,58.12 71.75,61.12 RFM23B.10 | 60.81,33.19 v59.5,34.5
  Bottom 0.203: v46.25,18.62 45.12,18.62 41,14.5 41,7.25 I2C_EXT.1 | v70.75,57.12 62.38,57.12 59.5,54.25 v59.5,34.5
SPI_MOSI  (via drill 0.5)
  Top 0.203: v65,38.88 65,37.5 62.38,34.88 61.75,34.88 IC2.15 | v75,55.88 75,59.88 73.75,61.12 RFM23B.11 | v60.12,3 40.38,3 38.75,4.62 I2C_EXT.4 | v77.62,43.25 v81.38,39.5
  Bottom 0.203: v65,38.88 65.5,38.88 65.75,38.62 70.25,38.62 74.94,43.31 | 74.94,43.31 75,43.38 v75,55.88 | v60.12,3 81.38,24.25 v81.38,39.5 | v77.62,43.25 75,43.25 74.94,43.31
SPI_NSS  (via drill 0.5)
  Top 0.203: RFM23B.13 77.75,61.12 77.5,60.88 77.5,56.12 R12.1 72,50.62 v72,49.38 | v60.5,35.5 60.62,35.62 61.62,35.62 IC2.14 | v31.12,18 23.25,10.12 23.25,7.25 I2C_EXT.15 | v60.25,39.38 v47,26.12
  Bottom 0.203: v60.5,35.5 60.5,38.62 60.75,38.88 | 60.75,38.88 66.25,44.38 67,44.38 v72,49.38 | v31.12,18 31.12,19.5 38.5,26.88 44.5,26.88 45.25,26.12 v47,26.12 | 60.75,38.88 v60.25,39.38
SPI_SCK  (via drill 0.5)
  Top 0.203: 61.44,29.19 53.88,21.62 53.88,14.62 45.25,6 39.5,6 38.38,7.12 I2C_EXT.3 | 61.44,29.19 63.12,30.88 63.12,32.5 IC2.17 | v66.62,62 67.25,62.62 74.62,62.62 75.75,61.5 75.75,61.25 RFM23B.12 | 61.44,29.19 v62.12,28.5
  Bottom 0.203: v66.62,62 63.5,62 51,49.5 51,40.75 58.75,33 62.75,33 65.62,30.12 65.62,29.38 64.75,28.5 v62.12,28.5
TX  (via drill 0.5)
  Top 0.203: v53,19 53,17.88 R3.1 | v68.25,27.75 68.25,28.25 73.38,33.38 v73.38,36.75 | v69,37.12 69.38,37.5 69.38,37.62 69.75,38 70.25,38 IC2.30
  Bottom 0.203: v53,19 59.5,19 v68.25,27.75 | v73.38,36.75 72.38,36.75 72,37.12 v69,37.12
VCC  (via drill 0.5)
  Top 0.305: TMP112.5 69.85,13.97
  Top 0.406: LED.A 55.75,77.88 62.25,77.88 62.62,78.25 65,78.25 66.25,77 C8.A | RFM23B.5 75.75,77.12 75.75,76.88 74.62,75.75 67.38,75.75 66.38,76.75 C8.A | C8.A 65.75,77.25 65.75,69.5 C4.2 65.75,69.25 65.75,64.75 C7.1 65.88,64.5 v69.38,64.5 | U$3.3V 93.88,41.5 89.12,36.75 86.25,36.75 R2.1 86,36.75 84.12,38.62 81,38.62 77.5,42.12 R9.2 75.88,42.12 72.5,45.5 | 72.5,45.5 72.12,45.88 71.75,45.88 C9.1 71.62,45.75 71.62,45.25 v69,42.62 | 72.5,45.5 72.62,45.62 72.62,48.5 77.38,53.25 77.38,54.38 R12.2 77.5,54.12 v78.62,55.25 | 69.75,14 67.38,14 65.75,12.38 63.5,12.38 R8.2 | 69.75,14 69.85,13.97 | 69.75,14 70.62,14.88 70.62,19 R4.1 | 66.12,40 65.88,40 | 65.88,40 65.25,40 64.88,40.38 64.88,41 IC2.6 | 66.12,40 66.38,40.25 66.38,41 IC2.4 | 65.88,40 65.88,35.12 64.12,33.38 64.12,32.62 IC2.18 64,32.5 64,31 63,30 63,25.75 C10.1 62.88,25.62 62,24.75 62,23.25 63.38,21.88 63.38,12.5 R8.2 | C2.2 39.38,30.88 39.38,27.38 U1.5 39.25,27.25 39.25,26.5 v38.88,26.12 | R8.2 63.25,12.38 52.38,12.38 44.75,4.75 41,4.75 I2C_EXT.2 | v66.25,39.88 66.12,40
  Bottom 0.406: v78.62,55.25 v69.38,64.5 | v38.88,26.12 38.88,8.38 39.62,7.62 39.62,6 40.88,4.75 I2C_EXT.2 40.5,4.88 39,3.38 17.62,3.38 14.12,6.88 11.5,6.88 JP1.1 | v66.25,39.88 v69,42.62
VOICE  (via drill 0.5)
  Top 0.203: v71,41.12 68.88,41.12 IC2.1 | v10.38,18.12 10.38,11 6.38,7 JP1.5
  Bottom 0.203: v71,41.12 73.5,43.62 73.5,57.25 67.5,63.25 56.38,63.25 46,52.88 45.12,52.88 v10.38,18.12
XTAL1
  Top 0.203: IC2.7 64.08,41.16 64.08,45.58 65.45,46.95 Q1.1
XTAL2
  Top 0.203: IC2.8 63.2,41.16 63.2,46.08 62.33,46.95 Q1.4

### Text on the board
bPlace: License: http://goo.gl/3d71UJ
tNames: H1 | H4 | H3 | H5 | 20151208 | VCC | DQ | NSS | IRQ | SDA | SCL | RST | SCK | Mi | VOICE | A7 | DQ | NSS | IRQ | SDA | SCL | RST | SCK | Miso | GND | RX | GND | GND | GND | VCC | RX | TX | GND | GND | GND | Mosi | VCC | TX | Mo | OpenTRV.org.uk | A6 | 5V
bNames: Seal off solderpads with / hotmelt glue or silicone / glue